# EAGLE design MD2017_Ctrl (EAGLE 6.2)
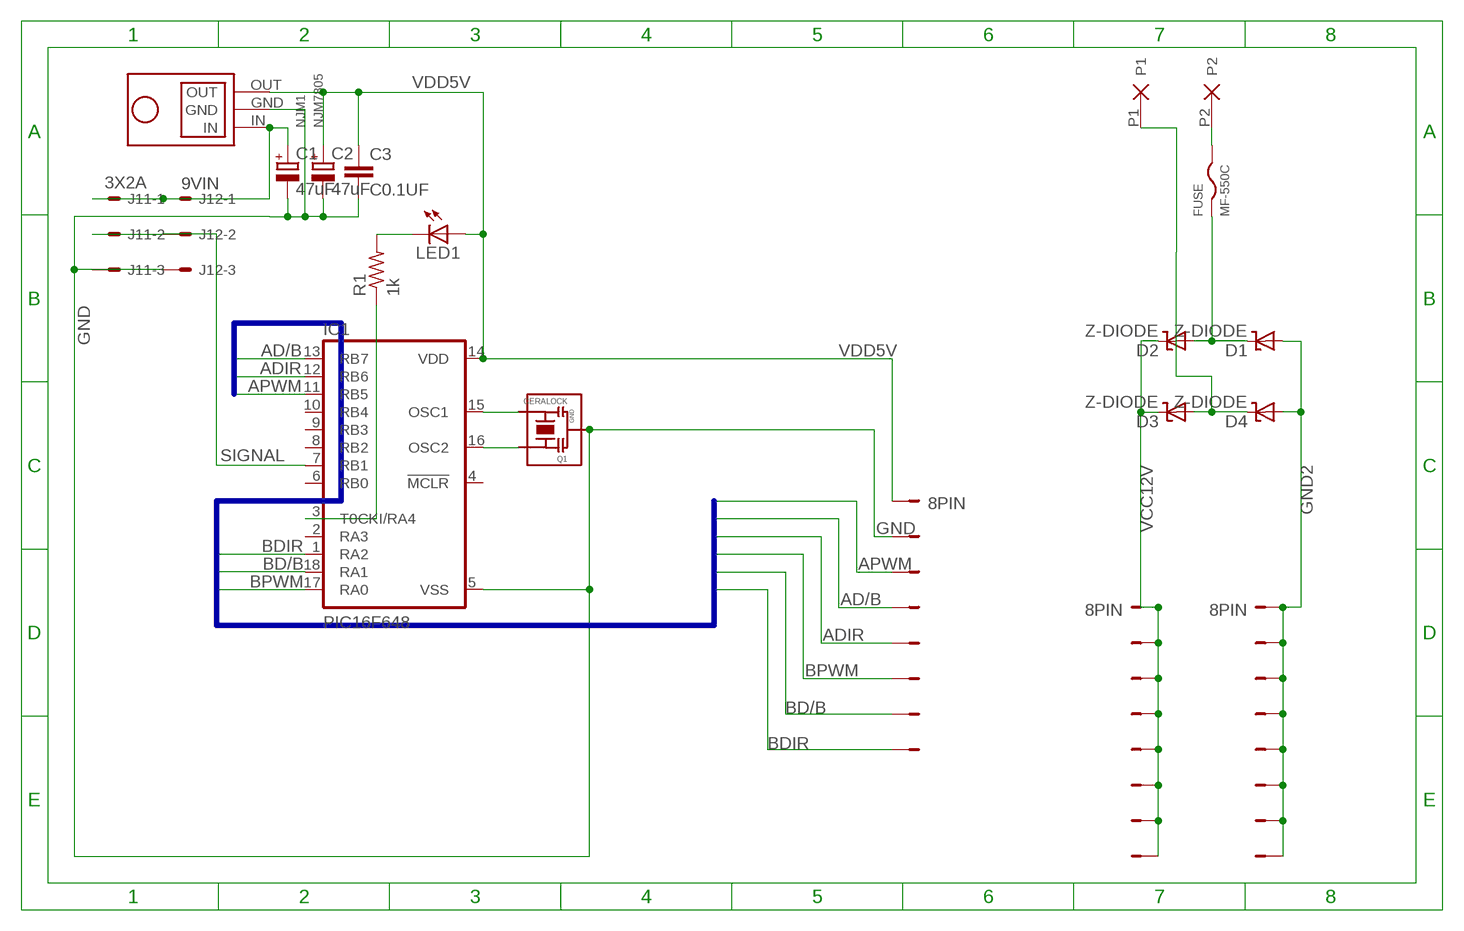
[diagram p0: schematic, sheet 1]

## Parts
C1  47uF  CPOL-EU2-5MM  [E2-5]
C2  47uF  CPOL-EU2-5MM  [E2-5]
C3  C0.1UF  [C0.1UF]
D1  Z-DIODE  [DO201-15]
D2  Z-DIODE  [DO201-15]
D3  Z-DIODE  [DO201-15]
D4  Z-DIODE  [DO201-15]
FUSE  MF-550C  [MF550C]
IC1  PIC16F648  [DIL18]
J1  3X2A  [37206-62A3-003]
LED1  LED5MM  [LED5MM]
NJM1  NJM7805  [NJM7805]
POWERNPORT  8PIN  [FH105-1X8SG]
POWERPPORT  8PIN  [FH105-1X8SG]
Q1  CERALOCK  [CERALOCK]
R1  1k  R-US_R3216W  [R3216W]
SIGNALPORT  8PIN  [FH105-1X8SG]
U$2  2P  [2P]

## Nets
9VIN: C1.+ J1.1-1 J1.2-1 NJM1.IN
AD/B: IC1.13(RB7) SIGNALPORT.4
ADIR: IC1.12(RB6) SIGNALPORT.5
APWM: IC1.11(RB5) SIGNALPORT.3
BATTA: FUSE.PB U$2.P2
BATTB: D3.A D4.C U$2.P1
BD/B: IC1.18(RA1) SIGNALPORT.7
BDIR: IC1.1(RA2) SIGNALPORT.8
BPWM: IC1.17(RA0) SIGNALPORT.6
CLK1: IC1.15(OSC1) Q1.P$3
CLK2: IC1.16(OSC2) Q1.P$1
GND: C1.- C2.- C3.2 IC1.5(VSS) J1.1-3 J1.2-3 NJM1.GND Q1.P$2 SIGNALPORT.2
GND2: D1.A D4.A POWERNPORT.1 POWERNPORT.2 POWERNPORT.3 POWERNPORT.4 POWERNPORT.5 POWERNPORT.6 POWERNPORT.7 POWERNPORT.8
N$1: D1.C D2.A FUSE.PA
N$2: IC1.3(T0CKI/RA4) R1.1
NLED1: LED1.K(C) R1.2
SIGNAL: IC1.7(RB1) J1.1-2 J1.2-2
VCC12V: D2.C D3.C POWERPPORT.1 POWERPPORT.2 POWERPPORT.3 POWERPPORT.4 POWERPPORT.5 POWERPPORT.6 POWERPPORT.7 POWERPPORT.8
VDD5V: C2.+ C3.1 IC1.14(VDD) LED1.A NJM1.OUT SIGNALPORT.1
Unconnected: IC1.2(RA3) IC1.4(!MCLR) IC1.6(RB0) IC1.8(RB2) IC1.9(RB3) IC1.10(RB4)

## Buses
B0

## Library data of the parts
C1 C2 = FP-21T for MITS:CPOL-EU2
C3 = FP-21T for MITS:C0.1UF
D1-D4 = diode:Z-DIODE: DIODE ultra fast rectifier, 3 A
FUSE = MF5xx:MF-5
IC1 = FP-21T for MITS:PIC16F648
J1 = 3M_372xx:3X2
LED1 = FP-21T for MITS:LED: LED OSRAM: - CHIPLED LG R971, LG N971, LY N971, LG Q971, LY Q971, LO R971, LY R971 LH N974, LH R974 LS Q976, LO Q976, LY Q976 LO Q996 - Hyper CHIPLED LW Q18S LB Q993, LB Q99A, LB R99A - SideLED LS A670, LO A670, LY A670, LG A670, LP A670 LB A673, LV A673, LT A673, LW A673 LH A674 LY A675 LS A676, LA A676, LO A676, LY A676, LW A676 LS A679, LY A679, LG A679 - Hyper Micro SIDELED® LS Y876, LA Y876, LO Y876, LY Y876 LT Y87S - SmartLED LW L88C, LW L88S LB L89C, LB L89S, LG L890 LS L89K, LO L89K, LY L89K LS L896, LA L896, LO L896, LY L896 - TOPLED LS T670, LO T670, LY T670, LG T670, LP T670 LSG T670, LSP T670, LSY T670, LOP T670, LYG T670 LG T671, LOG T671, LSG T671 LB T673, LV T673, LT T673, LW T673 LH T674 LS T676, LA T676, LO T676, LY T676, LB T676, LH T676, LSB T676, LW T676 LB T67C, LV T67C, LT T67C, LS T67K, LO T67K, LY T67K, LW E67C LS E67B, LA E67B, LO E67B, LY E67B, LB E67C, LV E67C, LT E67C LW T67C LS T679, LY T679, LG T679 LS T770, LO T770, LY T770, LG T770, LP T770 LB T773, LV T773, LT T773, LW T773 LH T774 LS E675, LA E675, LY E675, LS T675 LS T776, LA T776, LO T776, LY T776, LB T776 LHGB T686 LT T68C, LB T68C - Hyper Mini TOPLED® LB M676 - Mini TOPLED Santana® LG M470 LS M47K, LO M47K, LY M47K Source: http://www.osram.convergy.de - LUMILED® LXK2-PW12-R00, LXK2-PW12-S00, LXK2-PW14-U00, LXK2-PW14-V00 LXK2-PM12-R00, LXK2-PM12-S00, LXK2-PM14-U00 LXK2-PE12-Q00, LXK2-PE12-R00, LXK2-PE12-S00, LXK2-PE14-T00, LXK2-PE14-U00 LXK2-PB12-K00, LXK2-PB12-L00, LXK2-PB12-M00, LXK2-PB14-N00, LXK2-PB14-P00, LXK2-PB14-Q00 LXK2-PR12-L00, LXK2-PR12-M00, LXK2-PR14-Q00, LXK2-PR14-R00 LXK2-PD12-Q00, LXK2-PD12-R00, LXK2-PD12-S00 LXK2-PH12-R00, LXK2-PH12-S00 LXK2-PL12-P00, LXK2-PL12-Q00, LXK2-PL12-R00 Source: www.luxeon.com
NJM1 = My_NJM7805:NJM7805
POWERNPORT POWERPPORT SIGNALPORT = FH105:8PIN
Q1 = FP-21T for MITS:CERALOCK: CERALOCK CERAMIC RESONATOR
R1 = rcl:R-US_: RESISTOR, American symbol
U$2 = Powerio:2P

## Board
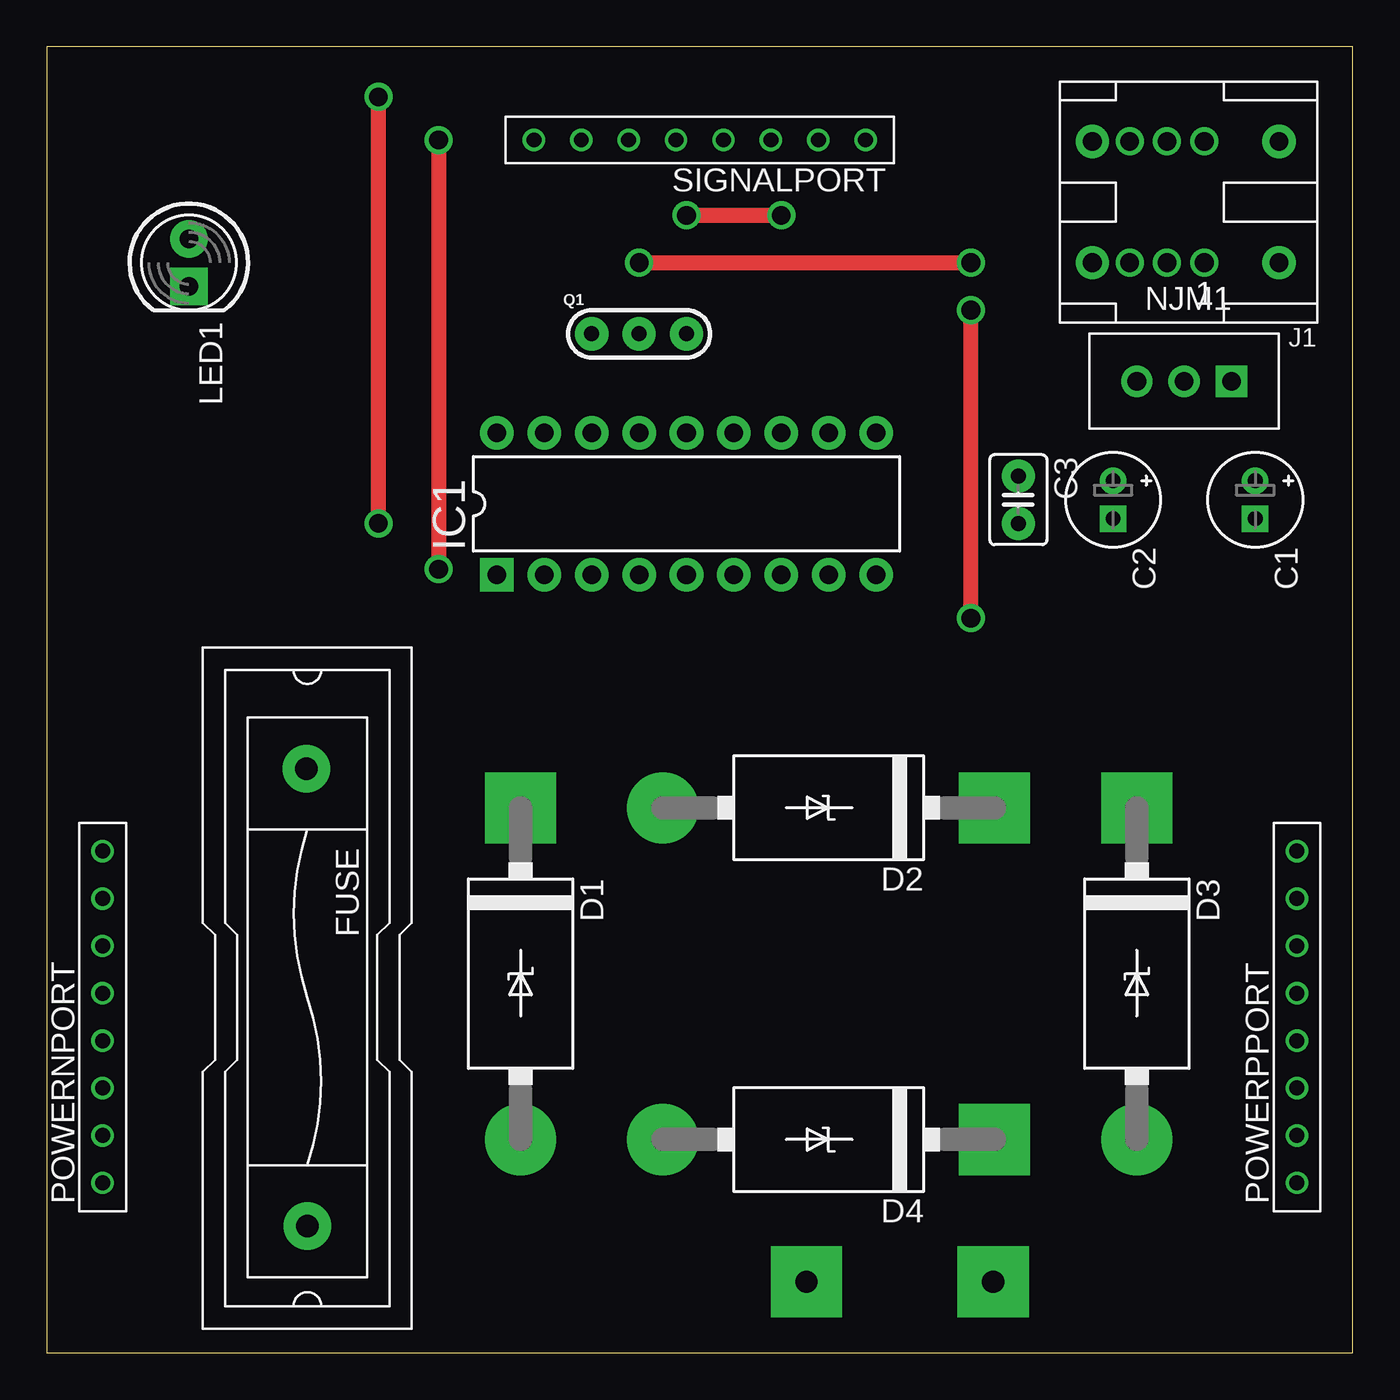
[diagram p1: board, top side]
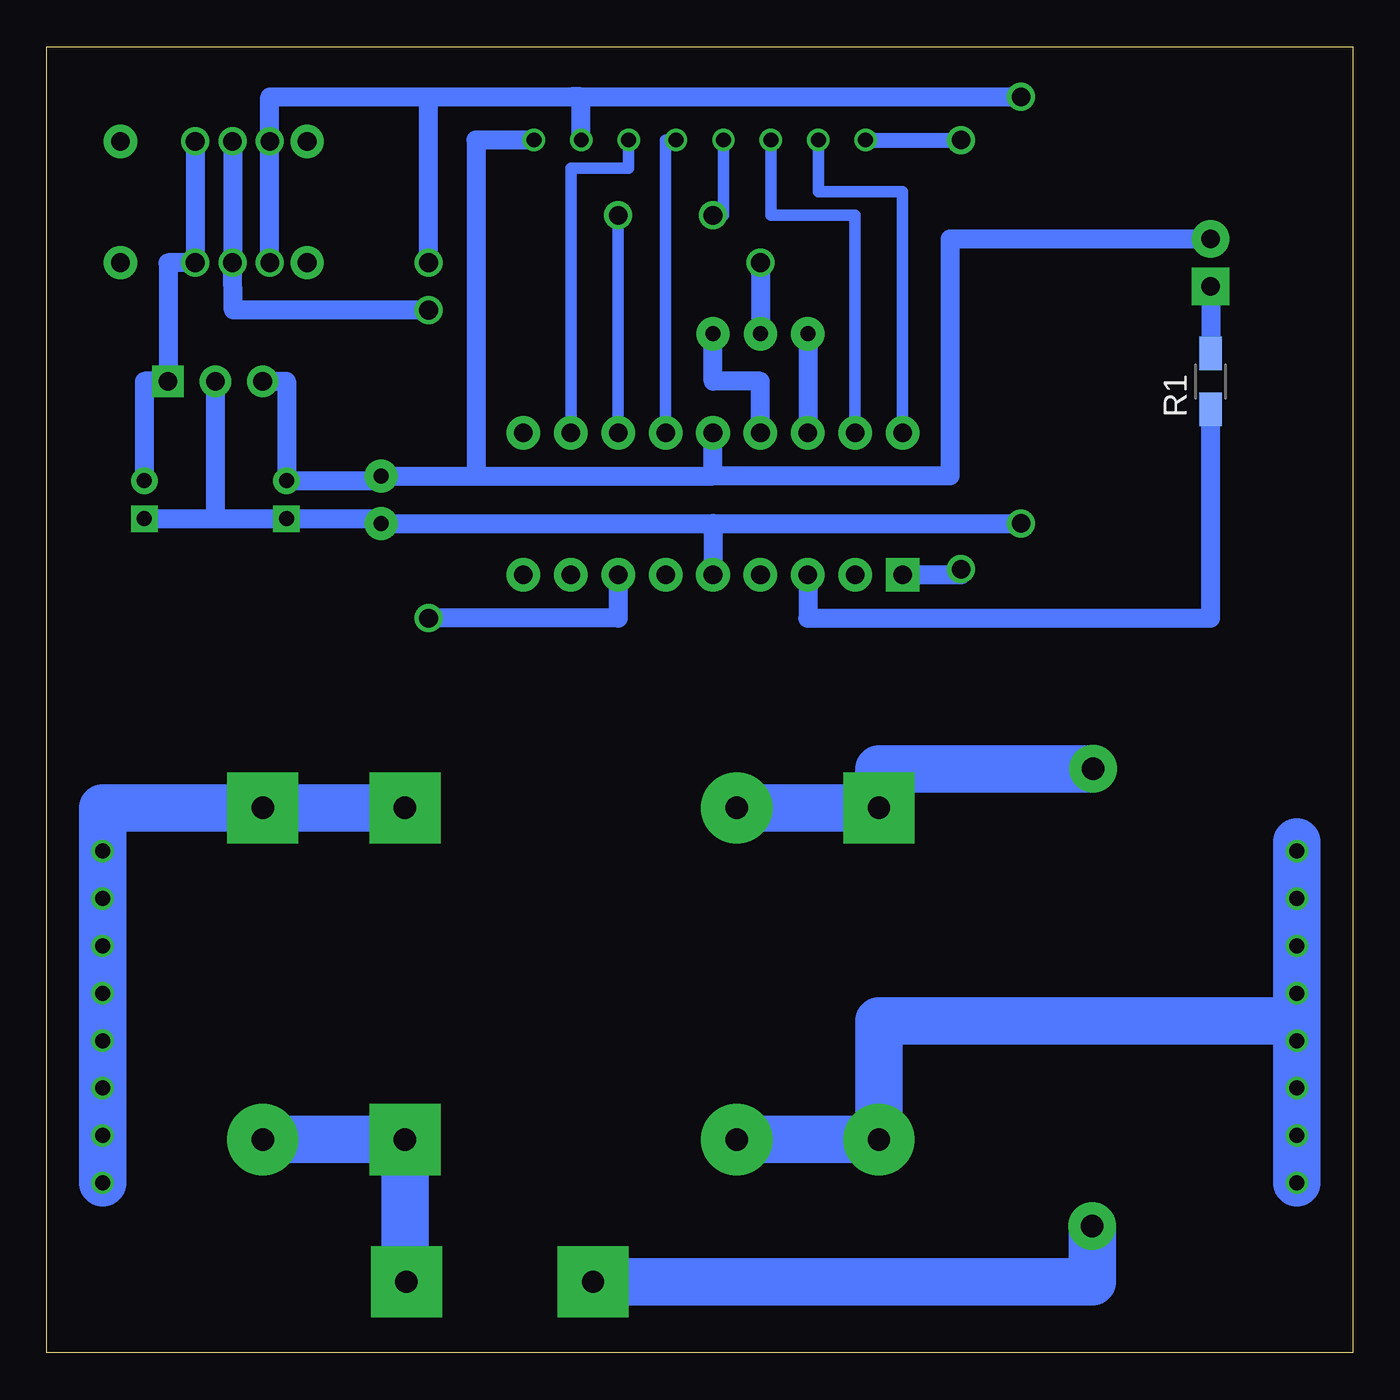
[diagram p2: board, bottom side, seen from below]

Size 70 x 70 mm. Coordinates in mm from the lower left corner, seen from the top.
Outline: 0,0 70,0 70,70 0,70 0,0
Copper layers (1*16): Top 0.035mm / dielectric 1.5mm / Bottom 0.035mm
Design rules: minimum track width 0.15mm, minimum drill 0.3mm, track to track 0.25mm, track to pad 0.25mm, pad to pad 0.25mm, via to via 0.25mm, smd to smd 0.2mm, copper to edge 0.7mm, drill to drill 0.45mm, minimum pad ring 0.15mm, minimum via ring 0.15mm, stop-mask expansion 4mil, vias tented up to drill 0mil, thermal gap 0.15mm

### Footprints (pad centres in the part's own frame; a part is rotated, then mirrored left to right if it is on the bottom)
E2-5 = drill 0.8 pad 1.422: + -1.016,0 | drill 0.8 pad 1.422 square: - 1.016,0
C0.1UF = drill 0.8 pad 1.778: 1 -1.27,0; 2 1.27,0
DO201-15 = drill 1.2 pad 3.81: A 8.89,0 | drill 1.2 pad 3.81 square: C -8.89,0
MF550C = drill 1.2 pad 2.54: PA -12.25,-0.05; PB 12.25,0
DIL18 = drill 1 pad 1.8 square: 1 -10.16,-3.81 | drill 1 pad 1.8: 2 -7.62,-3.81; 3 -5.08,-3.81; 4 -2.54,-3.81; 5 0,-3.81; 6 2.54,-3.81; 7 5.08,-3.81; 8 7.62,-3.81; 9 10.16,-3.81; 10 10.16,3.81; 11 7.62,3.81; 12 5.08,3.81; 13 2.54,3.81; 14 0,3.81; 15 -2.54,3.81; 16 -5.08,3.81; 17 -7.62,3.81; 18 -10.16,3.81
37206-62A3-003 = drill 1: 1-1 0,4; 1-2 0,6; 1-3 0,8; 2-1 6.5,4; 2-2 6.5,6; 2-3 6.5,8 | drill 1 pad 1.778: P$1 0,0; P$2 0,10; P$3 6.5,0; P$4 6.5,10
LED5MM = drill 1 pad 2: A -1.27,0 | drill 1 pad 2 square: K 1.27,0
NJM7805 = drill 1 pad 1.676: GND 0,0; OUT 2.54,0 | drill 1 pad 1.676 square: IN -2.54,0
FH105-1X8SG = drill 0.8: 1 -8.89,0; 2 -6.35,0; 3 -3.81,0; 4 -1.27,0; 5 1.27,0; 6 3.81,0; 7 6.35,0; 8 8.89,0
CERALOCK = drill 0.8 pad 1.778: P$1 -2.54,0; P$2 0,0; P$3 2.54,0
R3216W = smd 1.8 x 1.2: 1 -1.499,0; 2 1.499,0
2P = drill 1.2 pad 3.81 square: P1 -5,0; P2 5,0

### Placement (x,y rotation side)
C1  64.77,45.72 270 top
C2  57.15,45.72 270 top
C3  52.07,45.72 270 top
D1  25.4,20.32 270 top
D2  41.91,29.21 180 top
D3  58.42,20.32 270 top
D4  41.91,11.43 180 top
FUSE  13.97,19.05 270 top
IC1  34.29,45.5 0 top
J1  66.04,58.42 90 top
LED1  7.62,58.42 270 top
NJM1  60.96,52.07 180 top
POWERNPORT  3,18 90 top
POWERPPORT  67,18 90 top
Q1  31.75,54.61 0 top
R1  7.62,52.07 90 bottom
SIGNALPORT  35,65 180 top
U$2  45.72,3.81 180 top

### Tracks (layer width: path | path; a pad name or v marks a point on that pad's centre or on a via)
9VIN
  Bottom 1.016: J1.2-1 J1.1-1 63.5,58.42 NJM1.IN 64.77,52.07 C1.+
AD/B
  Bottom 0.61: IC1.13 36.83,65 SIGNALPORT.4
ADIR  (via drill 1)
  Top 0.813: v34.29,60.96 v39.37,60.96
  Bottom 0.61: IC1.12 v39.37,60.96 | SIGNALPORT.5 33.73,60.96 v34.29,60.96
APWM
  Bottom 0.61: IC1.11 41.91,63.5 39.37,63.5 38.81,63.5 SIGNALPORT.3
BATTA
  Bottom 2.54: U$2.P2 13.97,3.81 FUSE.PB
BATTB
  Bottom 2.54: D3.A D4.C 50.8,3.81 U$2.P1
BD/B
  Bottom 0.61: IC1.18 24.13,62.23 27.94,62.23 28.65,62.23 SIGNALPORT.7
BDIR  (via drill 1)
  Top 0.813: v21,65 v21,42
  Bottom 0.813: SIGNALPORT.8 v21,65
  Bottom 1.016: v21,42 21,41.69 IC1.1
BPWM
  Bottom 0.61: SIGNALPORT.6 31.19,60.96 26.67,60.96 IC1.17
CLK1
  Bottom 1.016: IC1.15 31.75,52.07 34.29,52.07 Q1.P$3
CLK2
  Bottom 1.016: Q1.P$1 IC1.16
GND  (via drill 1)
  Top 0.813: v17.78,44.45 v17.78,67.31 | v31.75,58.42 v49.53,58.42
  Bottom 1.016: C1.- 60.96,44.7 | 60.96,44.7 C2.- 52.07,44.7 C3.2 34.29,44.45 | NJM1.GND 60.96,44.7 | 34.29,44.45 IC1.5 | 34.29,44.45 v17.78,44.45 | v31.75,58.42 Q1.P$2 | J1.2-3 J1.1-3 58.04,67.31 49.53,67.31 | 49.53,67.31 41.91,67.31 | 41.91,67.31 v17.78,67.31 | SIGNALPORT.2 41.35,67.31 41.91,67.31 | v49.53,58.42 49.53,67.31
GND2
  Bottom 2.54: 3,27.39 POWERNPORT.8 POWERNPORT.7 POWERNPORT.6 POWERNPORT.5 3,17.78 | 3,17.78 POWERNPORT.4 POWERNPORT.3 POWERNPORT.2 POWERNPORT.1 | D4.A D1.A 25.4,17.78 3,17.78
N$1
  Bottom 2.54: D2.A D1.C 25.4,31.3 FUSE.PA
N$2
  Bottom 1.016: IC1.3 29.21,39.37 7.62,39.37 R1.1
NLED1
  Bottom 1.016: LED1.K R1.2
SIGNAL  (via drill 1)
  Top 0.813: v49.53,39.37 v49.53,55.88
  Bottom 1.016: J1.2-2 J1.1-2 60,55.88 v49.53,55.88 | IC1.7 39.37,39.37 v49.53,39.37
VCC12V
  Bottom 2.54: POWERPPORT.1 POWERPPORT.2 POWERPPORT.3 POWERPPORT.4 POWERPPORT.5 POWERPPORT.6 POWERPPORT.7 POWERPPORT.8 67,29.21 D3.C D2.C
VDD5V
  Bottom 1.016: NJM1.OUT 57.15,52.07 C2.+ 52.07,46.74 C3.1 46.99,46.99 | 46.99,46.99 34.29,46.99 | 34.29,46.99 IC1.14 | LED1.A 21.59,59.69 21.59,46.99 34.29,46.99 | SIGNALPORT.1 46.99,65 46.99,46.99